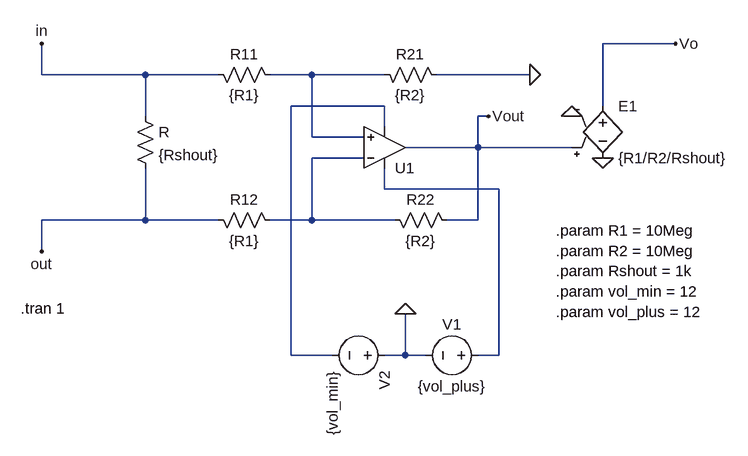
[diagram p0: schematic CuMeas.asc]
CuMeas.asc, the LTspice schematic file:
Version 4
SHEET 1 1700 680
WIRE 1104 -192 992 -192
WIRE 128 -144 128 -192
WIRE 288 -144 128 -144
WIRE 400 -144 288 -144
WIRE 544 -144 480 -144
WIRE 656 -144 544 -144
WIRE 880 -144 736 -144
WIRE 656 -96 512 -96
WIRE 992 -96 992 -192
WIRE 288 -80 288 -144
WIRE 816 -80 800 -80
WIRE 656 -64 656 -96
WIRE 544 -48 544 -144
WIRE 624 -48 544 -48
WIRE 800 -32 800 -80
WIRE 800 -32 688 -32
WIRE 944 -32 800 -32
WIRE 624 -16 544 -16
WIRE 656 32 656 0
WIRE 832 32 656 32
WIRE 288 80 288 0
WIRE 288 80 128 80
WIRE 400 80 288 80
WIRE 544 80 544 -16
WIRE 544 80 480 80
WIRE 672 80 544 80
WIRE 800 80 800 -32
WIRE 800 80 752 80
WIRE 128 128 128 80
WIRE 512 288 512 -96
WIRE 576 288 512 288
WIRE 688 288 688 224
WIRE 688 288 656 288
WIRE 720 288 688 288
WIRE 832 288 832 32
WIRE 832 288 800 288
FLAG 880 -144 0
FLAG 816 -80 Vout
FLAG 128 -192 in
FLAG 128 128 out
FLAG 944 -80 0
FLAG 1104 -192 Vo
FLAG 992 -16 0
FLAG 688 224 0
SYMBOL Opamps\\UniversalOpamp2 656 -32 M180
SYMATTR InstName U1
SYMBOL res 768 96 M270
WINDOW 0 32 56 VTop 2
WINDOW 3 0 56 VBottom 2
SYMATTR InstName R22
SYMATTR Value {R2}
SYMBOL res 752 -128 M270
WINDOW 0 32 56 VTop 2
WINDOW 3 0 56 VBottom 2
SYMATTR InstName R21
SYMATTR Value {R2}
SYMBOL res 496 96 M270
WINDOW 0 32 56 VTop 2
WINDOW 3 0 56 VBottom 2
SYMATTR InstName R12
SYMATTR Value {R1}
SYMBOL res 496 -128 M270
WINDOW 0 32 56 VTop 2
WINDOW 3 0 56 VBottom 2
SYMATTR InstName R11
SYMATTR Value {R1}
SYMBOL res 272 -96 R0
SYMATTR InstName R
SYMATTR Value {Rshout}
SYMBOL e2 992 -112 R0
SYMATTR InstName E1
SYMATTR Value {R1/R2/Rshout}
SYMBOL voltage 816 288 R90
WINDOW 0 -32 56 VBottom 2
WINDOW 3 32 56 VTop 2
SYMATTR InstName V1
SYMATTR Value {vol_plus}
SYMBOL voltage 672 288 R90
WINDOW 123 0 0 Left 2
WINDOW 39 0 0 Left 2
SYMATTR InstName V2
SYMATTR Value {vol_min}
TEXT 96 216 Left 2 !.tran 1
TEXT 920 96 Left 2 !.param R1 = 10Meg\n.param R2 = 10Meg\n.param Rshout = 1k\n.param vol_min = 12\n.param vol_plus = 12

The netlist it stands for:
* CuMeas.asc
XU1 N001 N003 N004 N002 Vout level.2 Avol=1Meg GBW=10Meg Slew=10Meg ilimit=25m rail=0 Vos=0 phimargin=45 en=0 enk=0 in=0 ink=0 Rin=500Meg  ; pins IN+ IN- V+ V- OUT
R22 Vout N003 {R2}
R21 0 N001 {R2}
R12 N003 out {R1}
R11 N001 in {R1}
R in out {Rshout}
E1 Vo 0 Vout 0 {R1/R2/Rshout}
V1 N004 0 {vol_plus}
V2 0 N002 {vol_min}
.tran 1
.param R1 = 10Meg
.param R2 = 10Meg
.param Rshout = 1k
.param vol_min = 12
.param vol_plus = 12
.lib UniversalOpamps2.sub
.backanno
.end